# EAGLE schematic LIC_rack_CV-00 (EAGLE 7.2.0)
AUTHOR: M. Petrilak; VERSION: 00

## Sheet 1 of 3
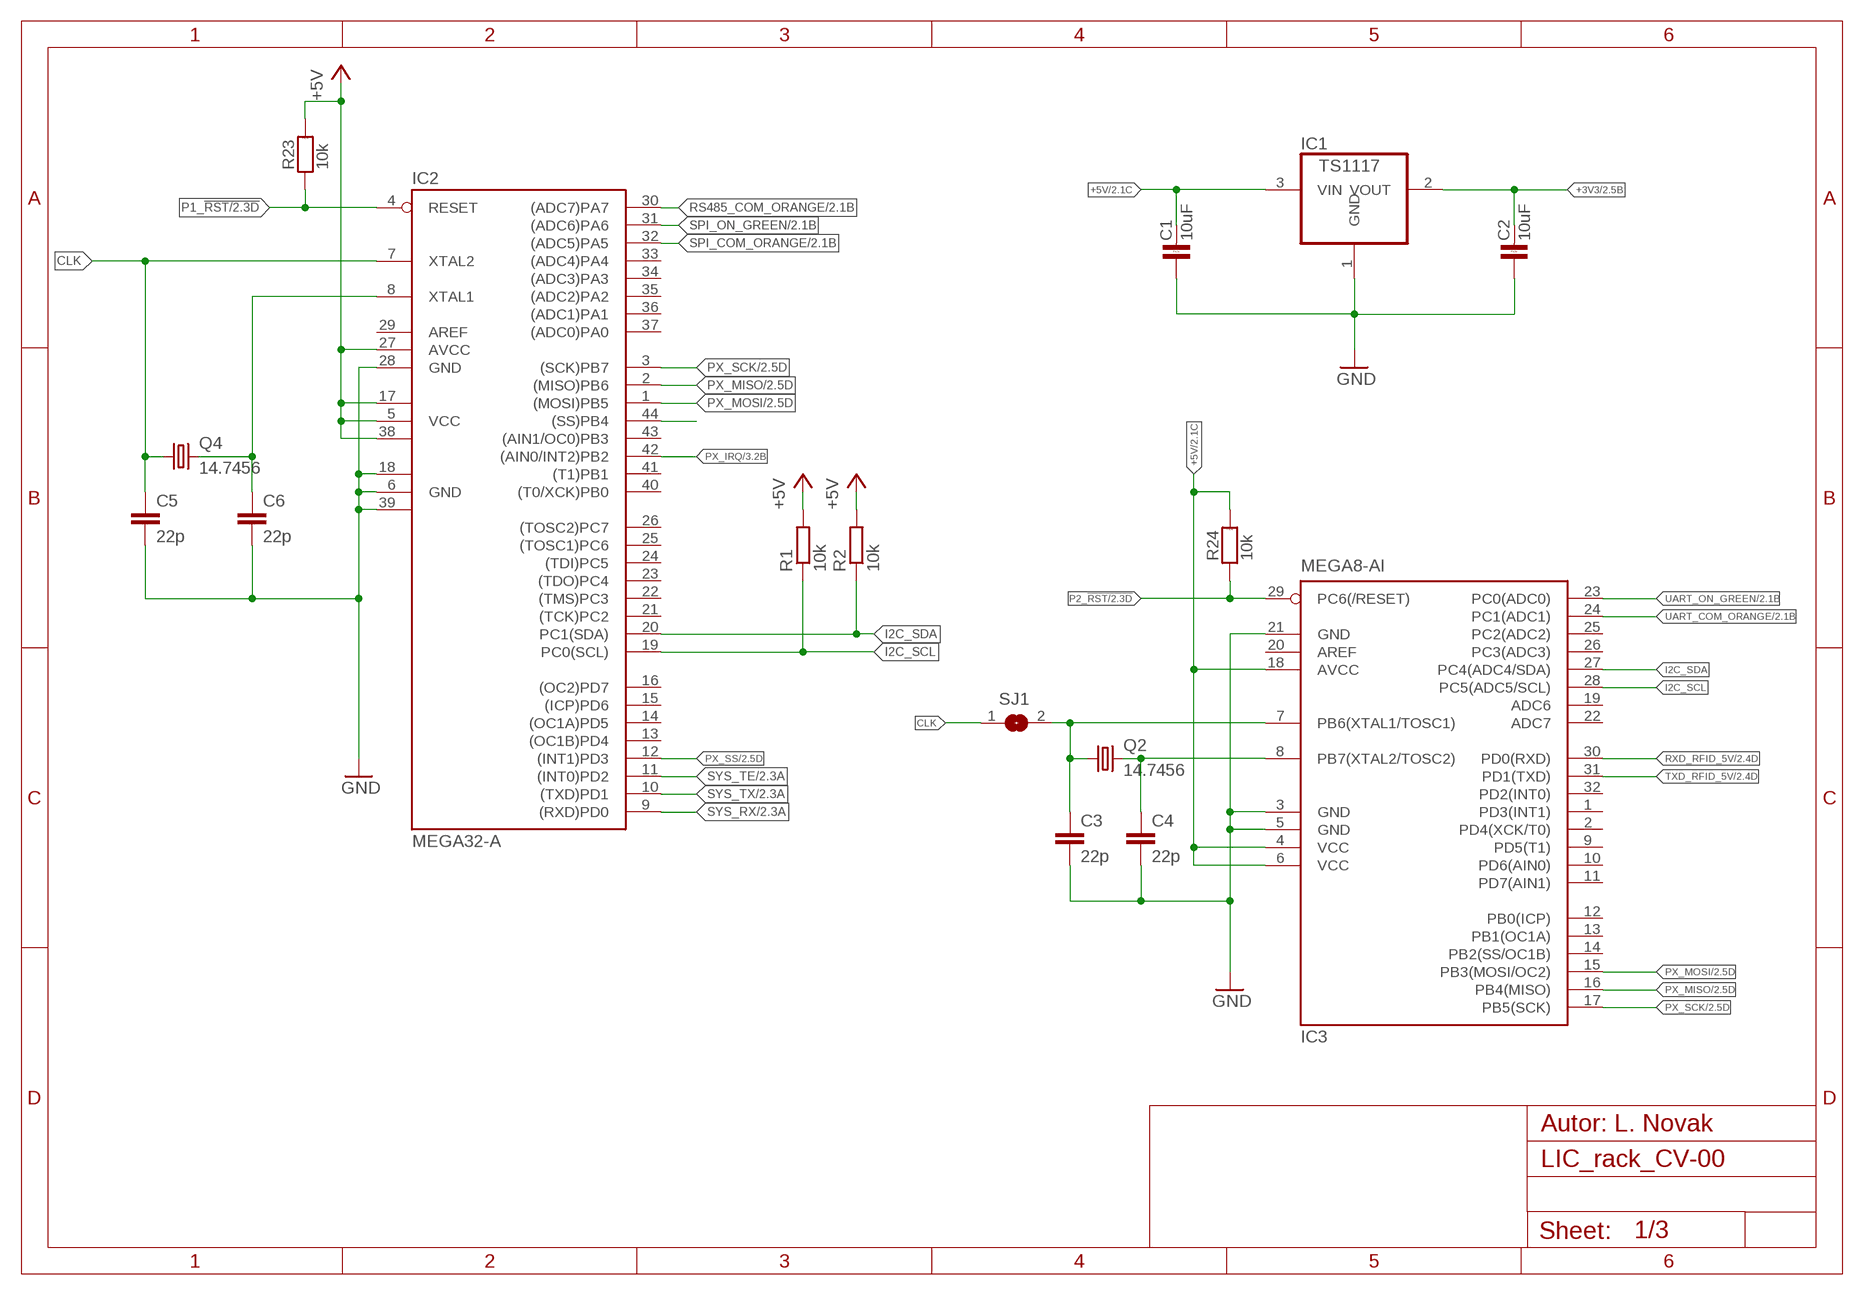
[diagram p0: schematic, sheet 1]

### Parts
C1  10uF  C-KER_1206  [1206]
C2  10uF  C-KER_1206  [1206]
C3  22p  C-EUC0805  [C0805]
C4  22p  C-EUC0805  [C0805]
C5  22p  C-EUC0805  [C0805]
C6  22p  C-EUC0805  [C0805]
IC1  TS1117  REG1117  [SOT223]
IC2  MEGA32-A  [TQFP44]
IC3  MEGA8-AI  [TQFP32-08]
Q2  14.7456  XTAL  [HC49U70]
Q4  14.7456  XTAL  [HC49U70]
R1  10k  R-EU_R1206  [R1206]
R2  10k  R-EU_R1206  [R1206]
R23  10k  R_1206  [1206]
R24  10k  R_1206  [1206]
SJ1  SJ  [SJ]

### Nets
+3V3: C2.2 IC1.2(VOUT) ; also sheet 2,3
+5V: C1.2 IC1.3(VIN) IC2.5(VCC) IC2.17(VCC1) IC2.27(AVCC) IC2.38(VCC2) IC3.4(VCC) IC3.6(VCC) IC3.18(AVCC) R1.2 R2.2 R23.2 R24.2 ; also sheet 2,3
CLK: C5.1 IC2.7(XTAL2) Q4.1 SJ1.1
CLK1: C3.1 IC3.7(PB6(XTAL1/TOSC1)) Q2.1 SJ1.2
GND: C1.1 C2.1 C3.2 C4.2 C5.2 C6.2 IC1.1(GND) IC2.6(GND) IC2.18(GND1) IC2.28(GND) IC2.39(GND2) IC3.3(GND) IC3.5(GND) IC3.21(GND) ; also sheet 2
I2C_SCL: IC2.19(PC0(SCL)) IC3.28(PC5(ADC5/SCL)) R1.1
I2C_SDA: IC2.20(PC1(SDA)) IC3.27(PC4(ADC4/SDA)) R2.1
N$3: C4.1 IC3.8(PB7(XTAL2/TOSC2)) Q2.2
N$4: IC2.44((SS)PB4)
N$19: C6.1 IC2.8(XTAL1) Q4.2
P1_!RST: IC2.4(RESET) R23.1 ; also sheet 2
P2_!RST: IC3.29(PC6(/RESET)) R24.1 ; also sheet 2
PX_IRQ: IC2.42((AIN0/INT2)PB2) ; also sheet 3
PX_MISO: IC2.2((MISO)PB6) IC3.16(PB4(MISO)) ; also sheet 2,3
PX_MOSI: IC2.1((MOSI)PB5) IC3.15(PB3(MOSI/OC2)) ; also sheet 2,3
PX_SCK: IC2.3((SCK)PB7) IC3.17(PB5(SCK)) ; also sheet 2,3
PX_SS: IC2.12((INT1)PD3) ; also sheet 2,3
RS485_COM_ORANGE: IC2.30((ADC7)PA7) ; also sheet 2
RXD_RFID_5V: IC3.30(PD0(RXD)) ; also sheet 2,3
SPI_COM_ORANGE: IC2.32((ADC5)PA5) ; also sheet 2
SPI_ON_GREEN: IC2.31((ADC6)PA6) ; also sheet 2
SYS_RX: IC2.9((RXD)PD0) ; also sheet 2
SYS_TE: IC2.11((INT0)PD2) ; also sheet 2
SYS_TX: IC2.10((TXD)PD1) ; also sheet 2
TXD_RFID_5V: IC3.31(PD1(TXD)) ; also sheet 2,3
UART_COM_ORANGE: IC3.24(PC1(ADC1)) ; also sheet 2
UART_ON_GREEN: IC3.23(PC0(ADC0)) ; also sheet 2
Unconnected: IC2.13((OC1B)PD4) IC2.14((OC1A)PD5) IC2.15((ICP)PD6) IC2.16((OC2)PD7) IC2.21((TCK)PC2) IC2.22((TMS)PC3) IC2.23((TDO)PC4) IC2.24((TDI)PC5) IC2.25((TOSC1)PC6) IC2.26((TOSC2)PC7) IC2.29(AREF) IC2.33((ADC4)PA4) IC2.34((ADC3)PA3) IC2.35((ADC2)PA2) IC2.36((ADC1)PA1) IC2.37((ADC0)PA0) IC2.40((T0/XCK)PB0) IC2.41((T1)PB1) IC2.43((AIN1/OC0)PB3) IC3.1(PD3(INT1)) IC3.2(PD4(XCK/T0)) IC3.9(PD5(T1)) IC3.10(PD6(AIN0)) IC3.11(PD7(AIN1)) IC3.12(PB0(ICP)) IC3.13(PB1(OC1A)) IC3.14(PB2(SS/OC1B)) IC3.19(ADC6) IC3.20(AREF) IC3.22(ADC7) IC3.25(PC2(ADC2)) IC3.26(PC3(ADC3)) IC3.32(PD2(INT0))

## Sheet 2 of 3
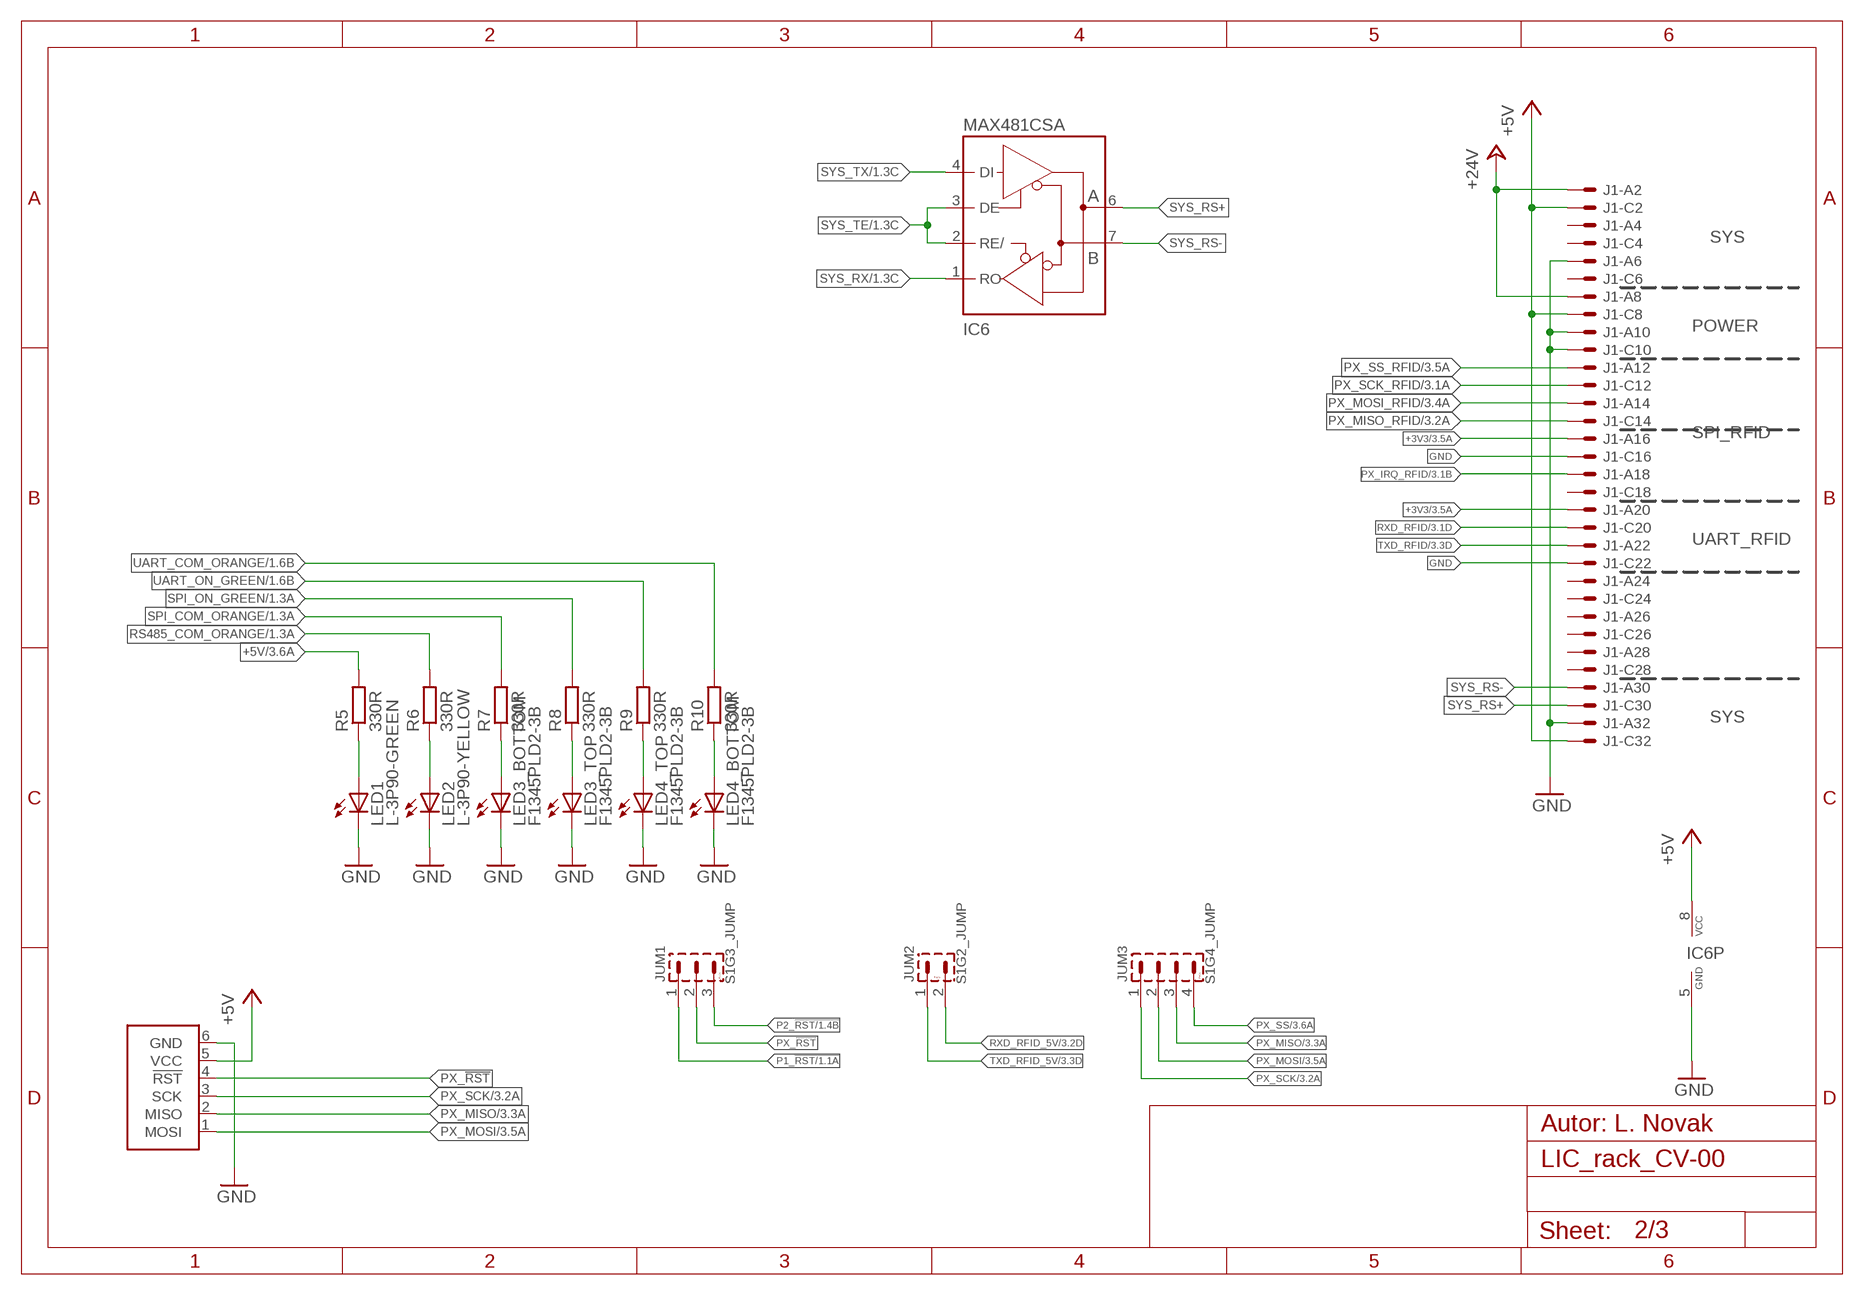
[diagram p1: schematic, sheet 2]

### Parts
IC6  MAX481CSA  [SO08]
J1  VG32SP  [VG32P]
JUM1  S1G3_JUMP  [S1G3_JUM]
JUM2  S1G2_JUMP  [S1G2_JUM]
JUM3  S1G4_JUMP  [S1G4_JUM]
LED1  L-3P90-GREEN  [L-3P90]
LED2  L-3P90-YELLOW  [L-3P90]
LED3  F1345PLD2-3B  [F1345PLD2-3B]
LED4  F1345PLD2-3B  [F1345PLD2-3B]
R5  330R  R-EU_R1206  [R1206]
R6  330R  R-EU_R1206  [R1206]
R7  330R  R-EU_R1206  [R1206]
R8  330R  R-EU_R1206  [R1206]
R9  330R  R-EU_R1206  [R1206]
R10  330R  R-EU_R1206  [R1206]
U1  ATPROG-V  [6410-06]

### Nets
+3V3: J1.A16 J1.A20 ; also sheet 1,3
+5V: IC6.8(VCC) J1.C2 J1.C8 J1.C32 R5.2 U1.5(VCC) ; also sheet 1,3
+24V: J1.A2 J1.A8
GND: IC6.5(GND) J1.A6 J1.A10 J1.A32 J1.C10 J1.C16 J1.C22 LED1.K(C) LED2.K(C) LED3.1K(C) LED3.2K(C) LED4.1K(C) LED4.2K(C) U1.6(GND) ; also sheet 1
N$1: LED2.A R6.1
N$2: LED1.A R5.1
N$9: LED4.1A(A) R10.1
N$10: LED4.2A(A) R9.1
N$11: LED3.2A(A) R8.1
N$12: LED3.1A(A) R7.1
P1_!RST: JUM1.1 ; also sheet 1
P2_!RST: JUM1.3 ; also sheet 1
PX_!RST: JUM1.2 U1.4(!RST)
PX_IRQ_RFID: J1.A18 ; also sheet 3
PX_MISO: JUM3.3 U1.2(MISO) ; also sheet 1,3
PX_MISO_RFID: J1.C14 ; also sheet 3
PX_MOSI: JUM3.2 U1.1(MOSI) ; also sheet 1,3
PX_MOSI_RFID: J1.A14 ; also sheet 3
PX_SCK: JUM3.1 U1.3(SCK) ; also sheet 1,3
PX_SCK_RFID: J1.C12 ; also sheet 3
PX_SS: JUM3.4 ; also sheet 1,3
PX_SS_RFID: J1.A12 ; also sheet 3
RS485_COM_ORANGE: R6.2 ; also sheet 1
RXD_RFID: J1.C20 ; also sheet 3
RXD_RFID_5V: JUM2.2 ; also sheet 1,3
SPI_COM_ORANGE: R7.2 ; also sheet 1
SPI_ON_GREEN: R8.2 ; also sheet 1
SYS_RS+: IC6.6(A) J1.C30
SYS_RS-: IC6.7(B) J1.A30
SYS_RX: IC6.1(RO) ; also sheet 1
SYS_TE: IC6.2(RE/) IC6.3(DE) ; also sheet 1
SYS_TX: IC6.4(DI) ; also sheet 1
TXD_RFID: J1.A22 ; also sheet 3
TXD_RFID_5V: JUM2.1 ; also sheet 1,3
UART_COM_ORANGE: R10.2 ; also sheet 1
UART_ON_GREEN: R9.2 ; also sheet 1
Unconnected: J1.A4 J1.A24 J1.A26 J1.A28 J1.C4 J1.C6 J1.C18 J1.C24 J1.C26 J1.C28

### Notes on the sheet
- SYS
- POWER
- SPI_RFID
- UART_RFID
- SYS

## Sheet 3 of 3
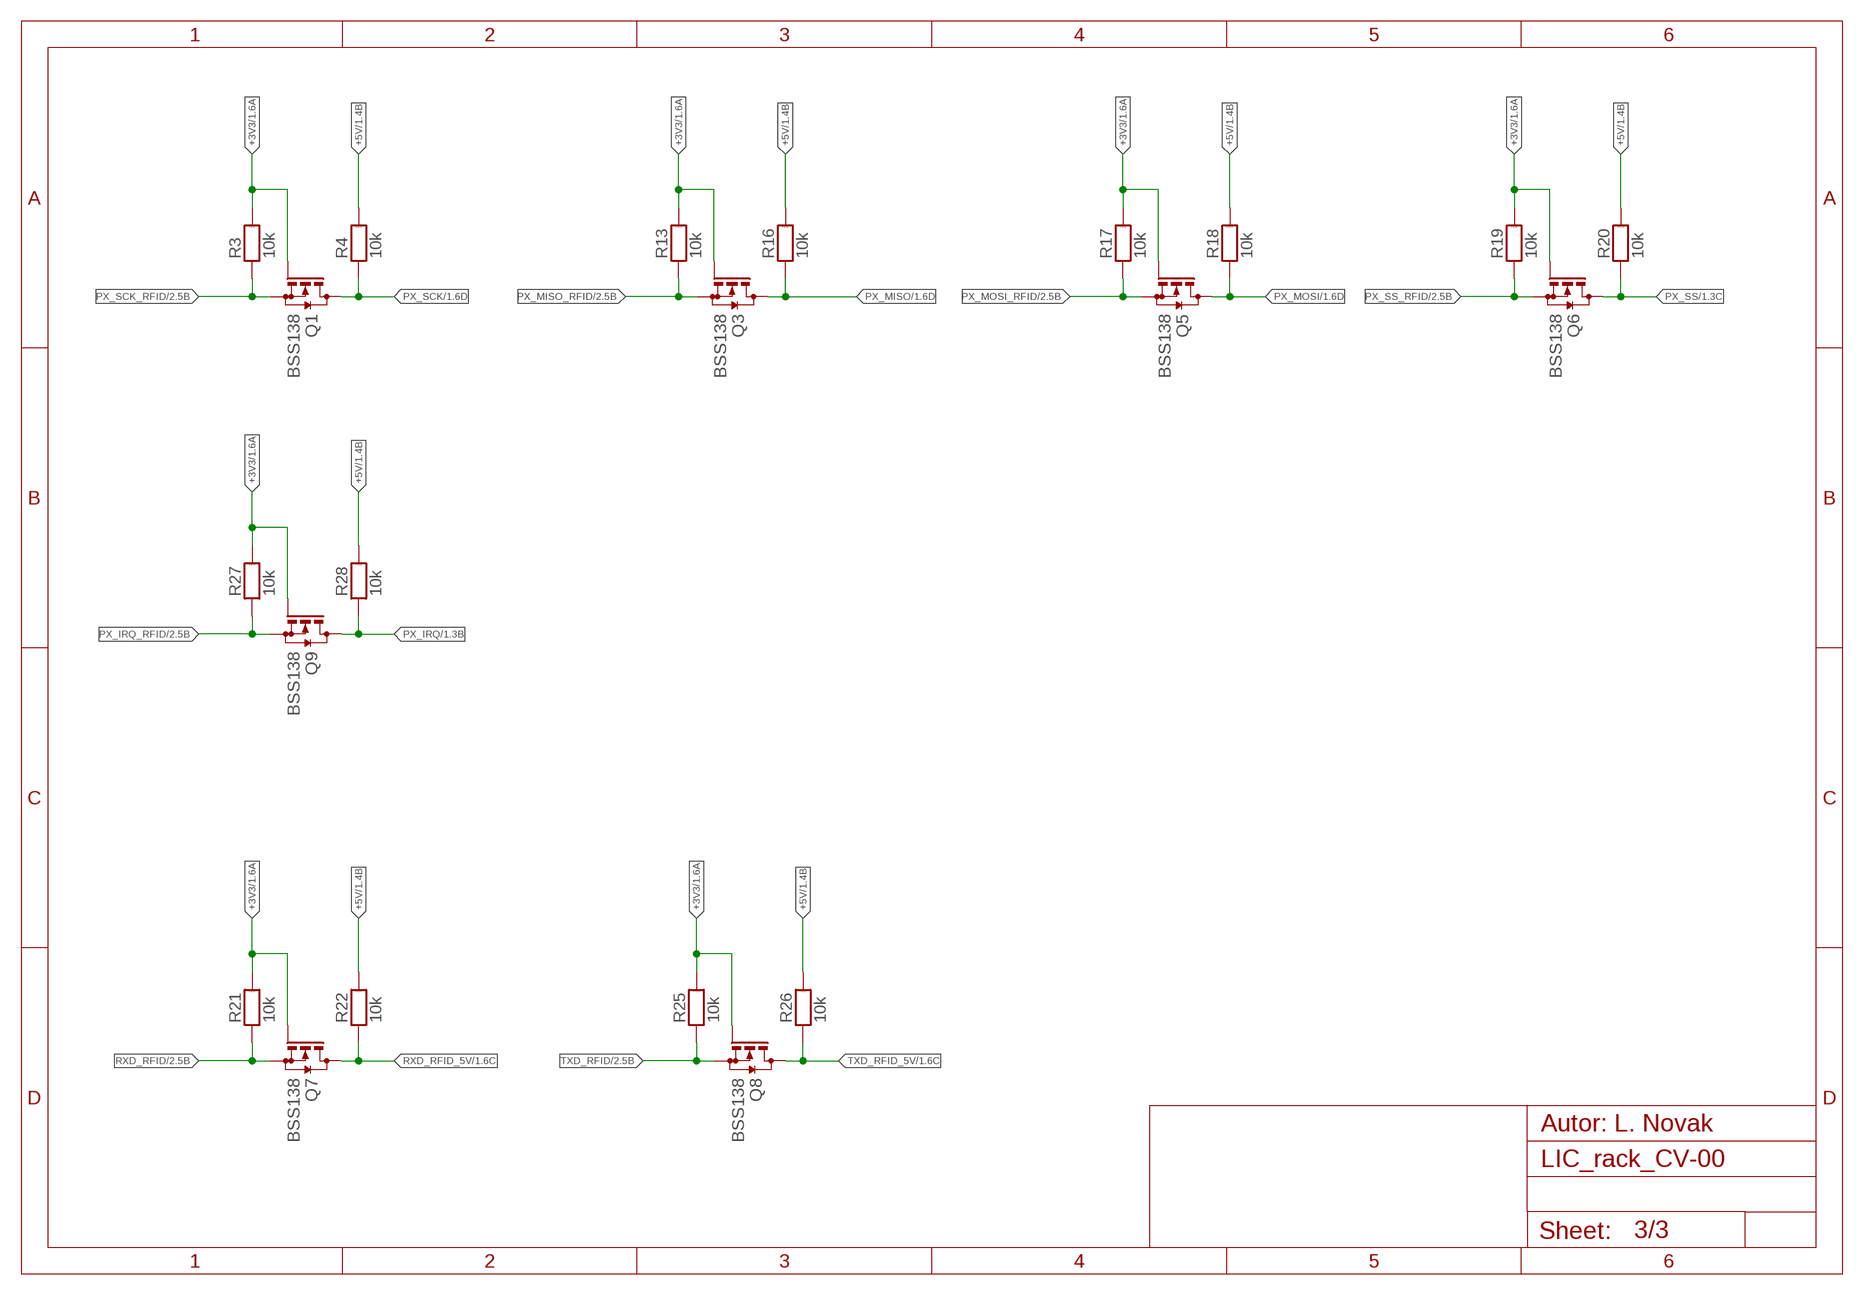
[diagram p2: schematic, sheet 3]

### Parts
Q1  BSS138  BSS123  [SOT23]
Q3  BSS138  BSS123  [SOT23]
Q5  BSS138  BSS123  [SOT23]
Q6  BSS138  BSS123  [SOT23]
Q7  BSS138  BSS123  [SOT23]
Q8  BSS138  BSS123  [SOT23]
Q9  BSS138  BSS123  [SOT23]
R3  10k  R_1206  [1206]
R4  10k  R_1206  [1206]
R13  10k  R_1206  [1206]
R16  10k  R_1206  [1206]
R17  10k  R_1206  [1206]
R18  10k  R_1206  [1206]
R19  10k  R_1206  [1206]
R20  10k  R_1206  [1206]
R21  10k  R_1206  [1206]
R22  10k  R_1206  [1206]
R25  10k  R_1206  [1206]
R26  10k  R_1206  [1206]
R27  10k  R_1206  [1206]
R28  10k  R_1206  [1206]

### Nets
+3V3: Q1.1(G) Q3.1(G) Q5.1(G) Q6.1(G) Q7.1(G) Q8.1(G) Q9.1(G) R3.2 R13.2 R17.2 R19.2 R21.2 R25.2 R27.2 ; also sheet 1,2
+5V: R4.2 R16.2 R18.2 R20.2 R22.2 R26.2 R28.2 ; also sheet 1,2
PX_IRQ: Q9.3(D) R28.1 ; also sheet 1
PX_IRQ_RFID: Q9.2(S) R27.1 ; also sheet 2
PX_MISO: Q3.3(D) R16.1 ; also sheet 1,2
PX_MISO_RFID: Q3.2(S) R13.1 ; also sheet 2
PX_MOSI: Q5.3(D) R18.1 ; also sheet 1,2
PX_MOSI_RFID: Q5.2(S) R17.1 ; also sheet 2
PX_SCK: Q1.3(D) R4.1 ; also sheet 1,2
PX_SCK_RFID: Q1.2(S) R3.1 ; also sheet 2
PX_SS: Q6.3(D) R20.1 ; also sheet 1,2
PX_SS_RFID: Q6.2(S) R19.1 ; also sheet 2
RXD_RFID: Q7.2(S) R21.1 ; also sheet 2
RXD_RFID_5V: Q7.3(D) R22.1 ; also sheet 1,2
TXD_RFID: Q8.2(S) R25.1 ; also sheet 2
TXD_RFID_5V: Q8.3(D) R26.1 ; also sheet 1,2

## Library data of the parts
C1 C2 = #PaJa_31:C-KER: Kondenzator - keramicky
C3-C6 = rcl:C-EU: CAPACITOR, European symbol
IC1 = burr-brown:REG1117: 800mA and 1A Low Dropout (LDO) Positive Regulator 1.8V, 2.5V, 2.85V, 3.3V, 5V, and Adj; MPN: REG1117; OC_FARNELL: 1097566; OC_NEWARK: 14P6981
IC2 = atmel:MEGA32: MICROCONTROLLER 32 Kbytes FLASH 2 Kbytes SRAM 1 Kbytes EEPROM USART 8-channel 10 bit ADC Source: www.atmel.com .. doc2503.pdf; MPN: ATMEGA32-16AU; OC_FARNELL: 9171274; OC_NEWARK: 69K6677
IC3 = atmel:MEGA8: MICROCONTROLLER 8 Kbytes FLASH, 1 kbytes SRAM, 512 bytes EEPROM, USART, 6-channel 10 bit ADC, 2-channel 8 bit ADC Pin compatible with Atmega48, ATMega88, ATMega168 Source: avr.lbr; MPN: ATMEGA8-16AU; OC_FARNELL: 9171371; OC_NEWARK: 73M8863
IC6 = maxim:MAX481CSA: RS485 TRANSEIVER
J1 = 19inch:VG32S: PCB EUROCARD, 32-pin type C/AC, 5.08 mm
JUM1 = #PaJa_konektory:S1G3_JUMP: Radove konektory - koliky - 3x
JUM2 = #PaJa_konektory:S1G2_JUMP: Radove konektory - koliky - 2x
JUM3 = #PaJa_konektory:S1G4_JUMP: Radove konektory - koliky - 4x
LED1 LED2 = led:L-3P90
LED3 LED4 = led:F1345PLD2-3B
Q1 Q3 Q5-Q9 = transistor-small-signal:BSS123: N-CHANNEL MOS FET
Q2 Q4 = crystal:XTAL
R1 R2 R5-R10 = rcl:R-EU_: RESISTOR, European symbol
R3 R4 R13 R16-R28 = #PaJa_31:R: Rezistor
SJ1 = jumper:SJ: SMD solder JUMPER
U1 = con-molex:ATPROG